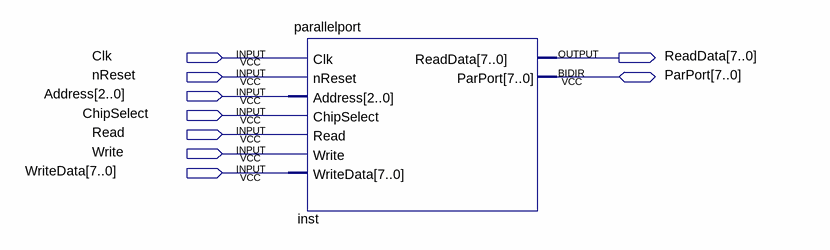
[diagram p0: schematic sheet]
// Quartus schematic parallelport.bdf as structural Verilog: 1 symbols, 9 pins
module parallelport (
  input  Clk,
  input  nReset,
  input  [2:0] Address,
  input  ChipSelect,
  input  Read,
  input  Write,
  input  [7:0] WriteData,
  inout  [7:0] ParPort,
  output [7:0] ReadData
);

  parallelport inst (
    .Clk(Clk), .nReset(nReset), .Address(Address), .ChipSelect(ChipSelect), .Read(Read), .Write(Write),
    .WriteData(WriteData), .ReadData(ReadData), .ParPort(ParPort));
endmodule
